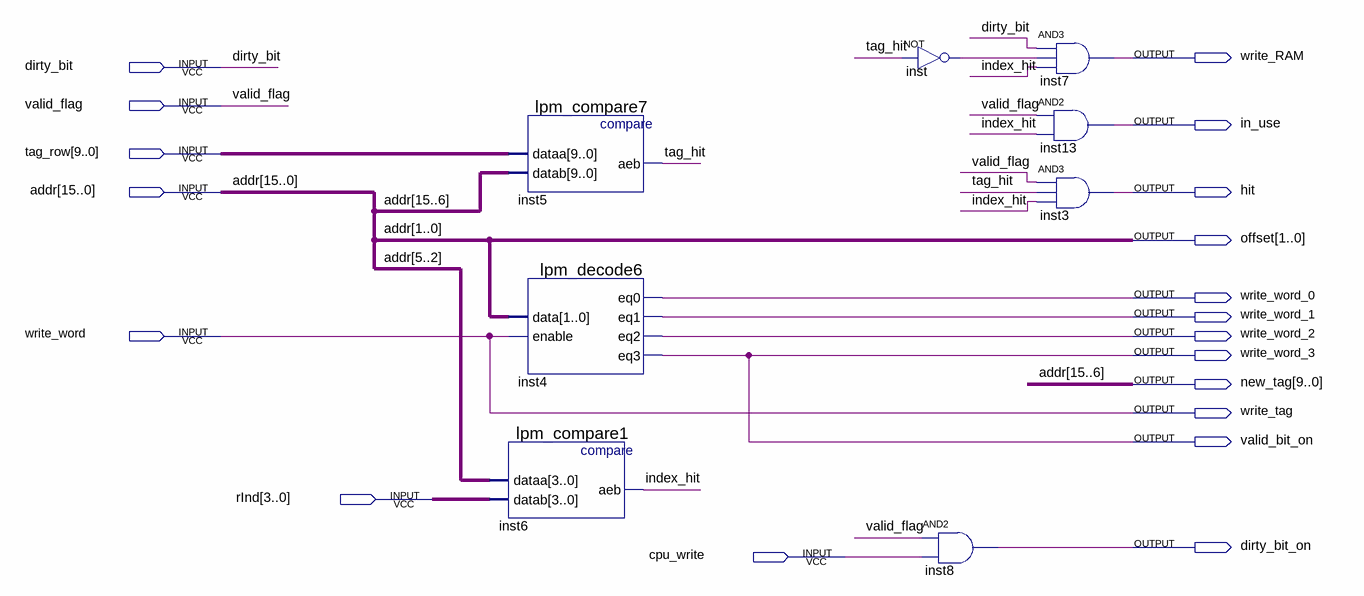
[diagram p0: schematic sheet]
// Quartus schematic cache_row_controller_unit.bdf as structural Verilog: 8 symbols, 19 pins
module cache_row_controller_unit (
  input  dirty_bit,
  input  valid_flag,
  input  [9:0] tag_row,
  input  [15:0] addr,
  input  write_word,
  input  [3:0] rInd,
  input  cpu_write,
  output write_RAM,
  output in_use,
  output hit,
  output [1:0] offset,
  output write_word_0,
  output write_word_1,
  output write_word_2,
  output write_word_3,
  output [9:0] new_tag,
  output write_tag,
  output valid_bit_on,
  output dirty_bit_on
);

  wire index_hit, inst_out, tag_hit;

  lpm_compare7 inst5 (.dataa(tag_row), .datab(addr[15:6]), .aeb(tag_hit));
  lpm_decode6 inst4 (
    .data(addr[1:0]), .enable(write_word), .eq0(write_word_0), .eq1(write_word_1), .eq2(write_word_2),
    .eq3(valid_bit_on));
  lpm_compare1 inst6 (.dataa(addr[5:2]), .datab(rInd), .aeb(index_hit));
  not inst (inst_out, tag_hit);
  and inst8 (dirty_bit_on, valid_flag, cpu_write);
  and inst7 (write_RAM, dirty_bit, inst_out, index_hit);
  and inst13 (in_use, valid_flag, index_hit);
  and inst3 (hit, valid_flag, tag_hit, index_hit);

  assign new_tag = addr[15:6];
  assign offset = addr[1:0];
  assign write_tag = write_word;
  assign write_word_3 = valid_bit_on;
endmodule
